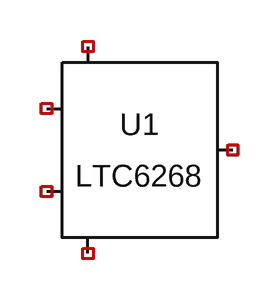
[diagram p0: schematic TIA.asc]
TIA.asc, the LTspice schematic file:
Version 4
SHEET 1 880 680
SYMBOL OpAmps\\LTC6268 208 128 R0
SYMATTR InstName U1

The netlist it stands for:
* TIA.asc
XU1 NC_01 NC_02 NC_03 NC_04 NC_05 NC_06 LTC6268
.lib LTC2.lib
.backanno
.end